# EAGLE board oresat-backplane-2u-hasp (EAGLE 9.6.2)
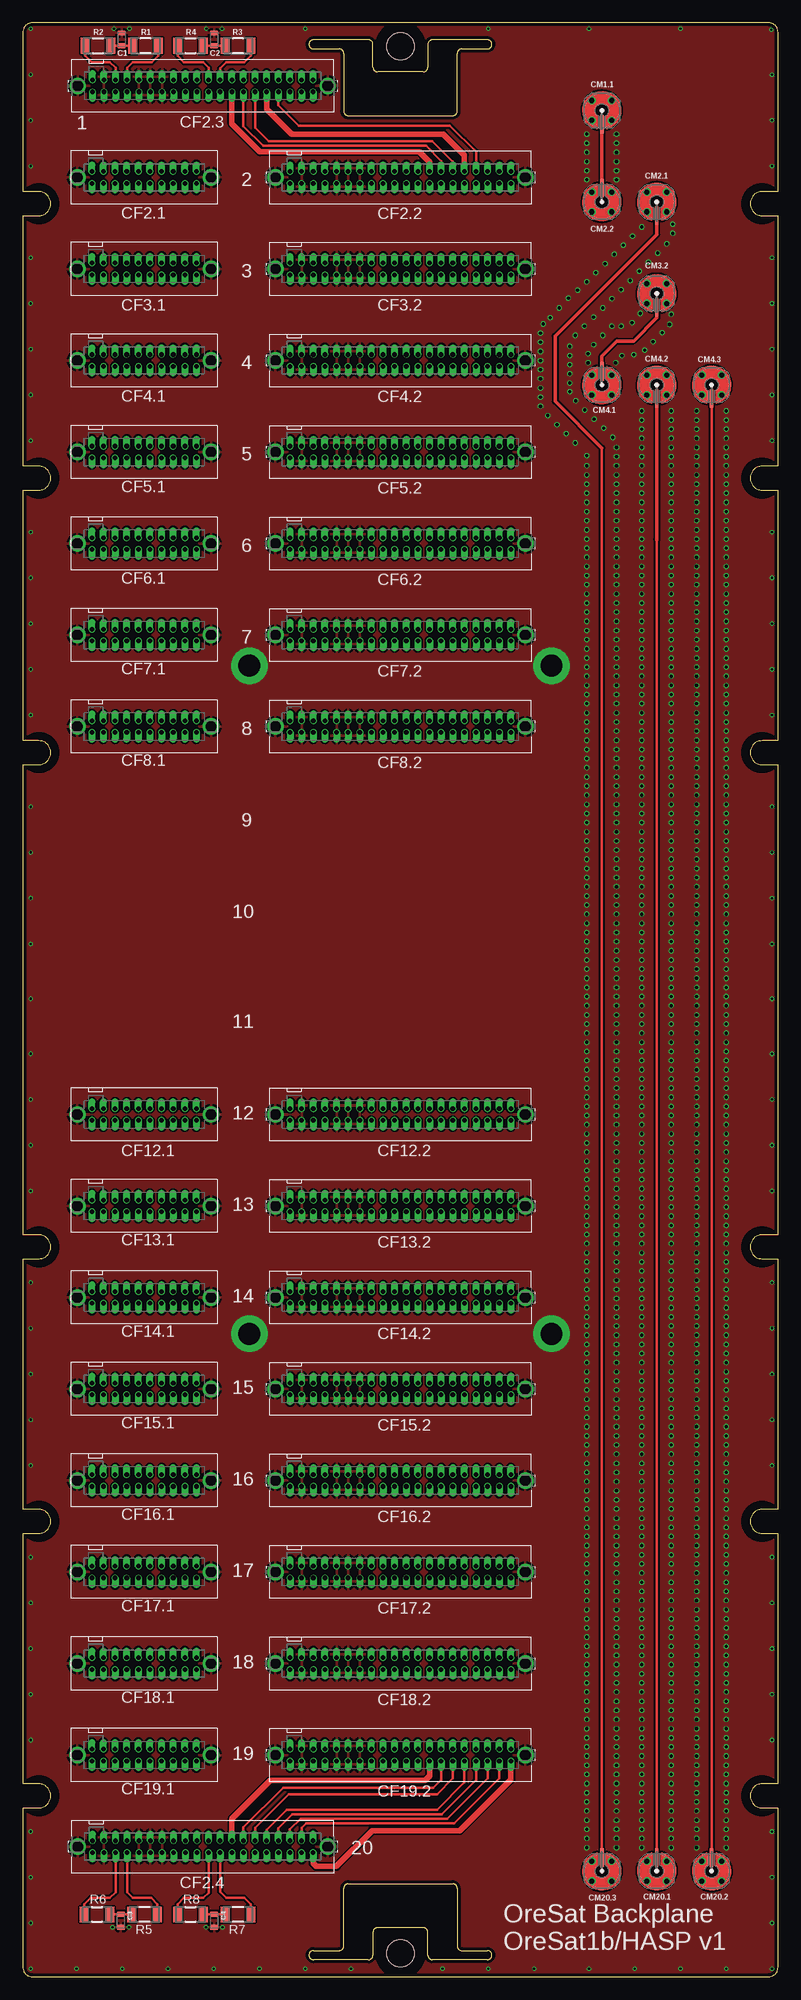
[diagram p20: board, top side]
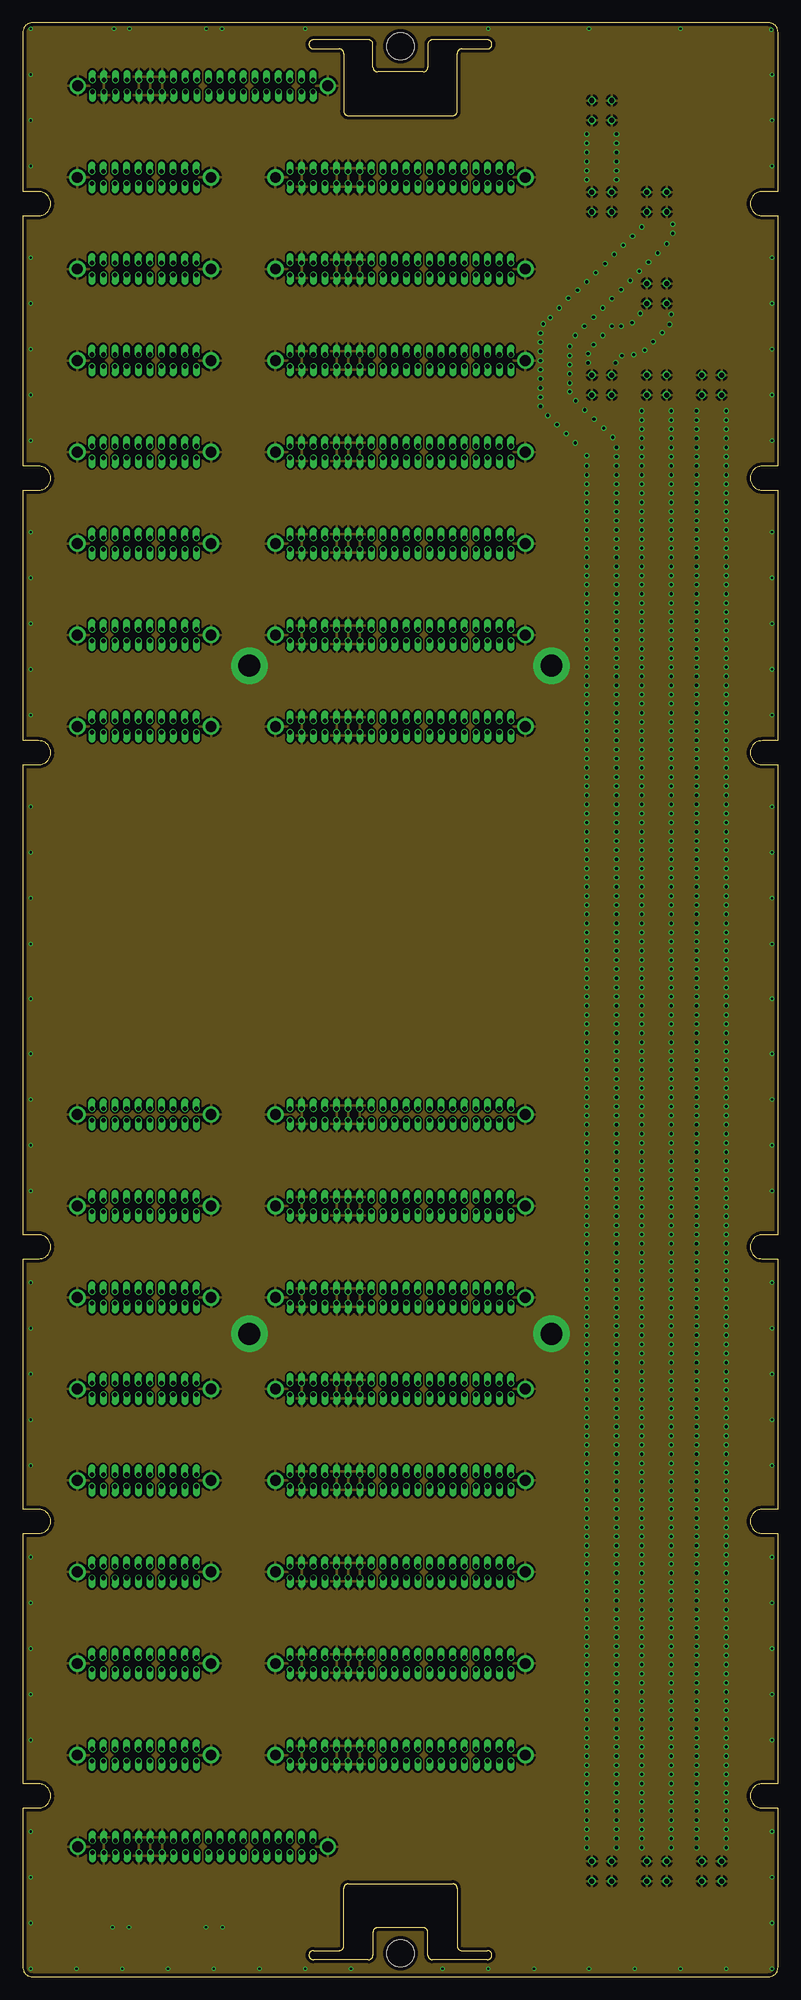
[diagram p21: board, inner layer Route2]
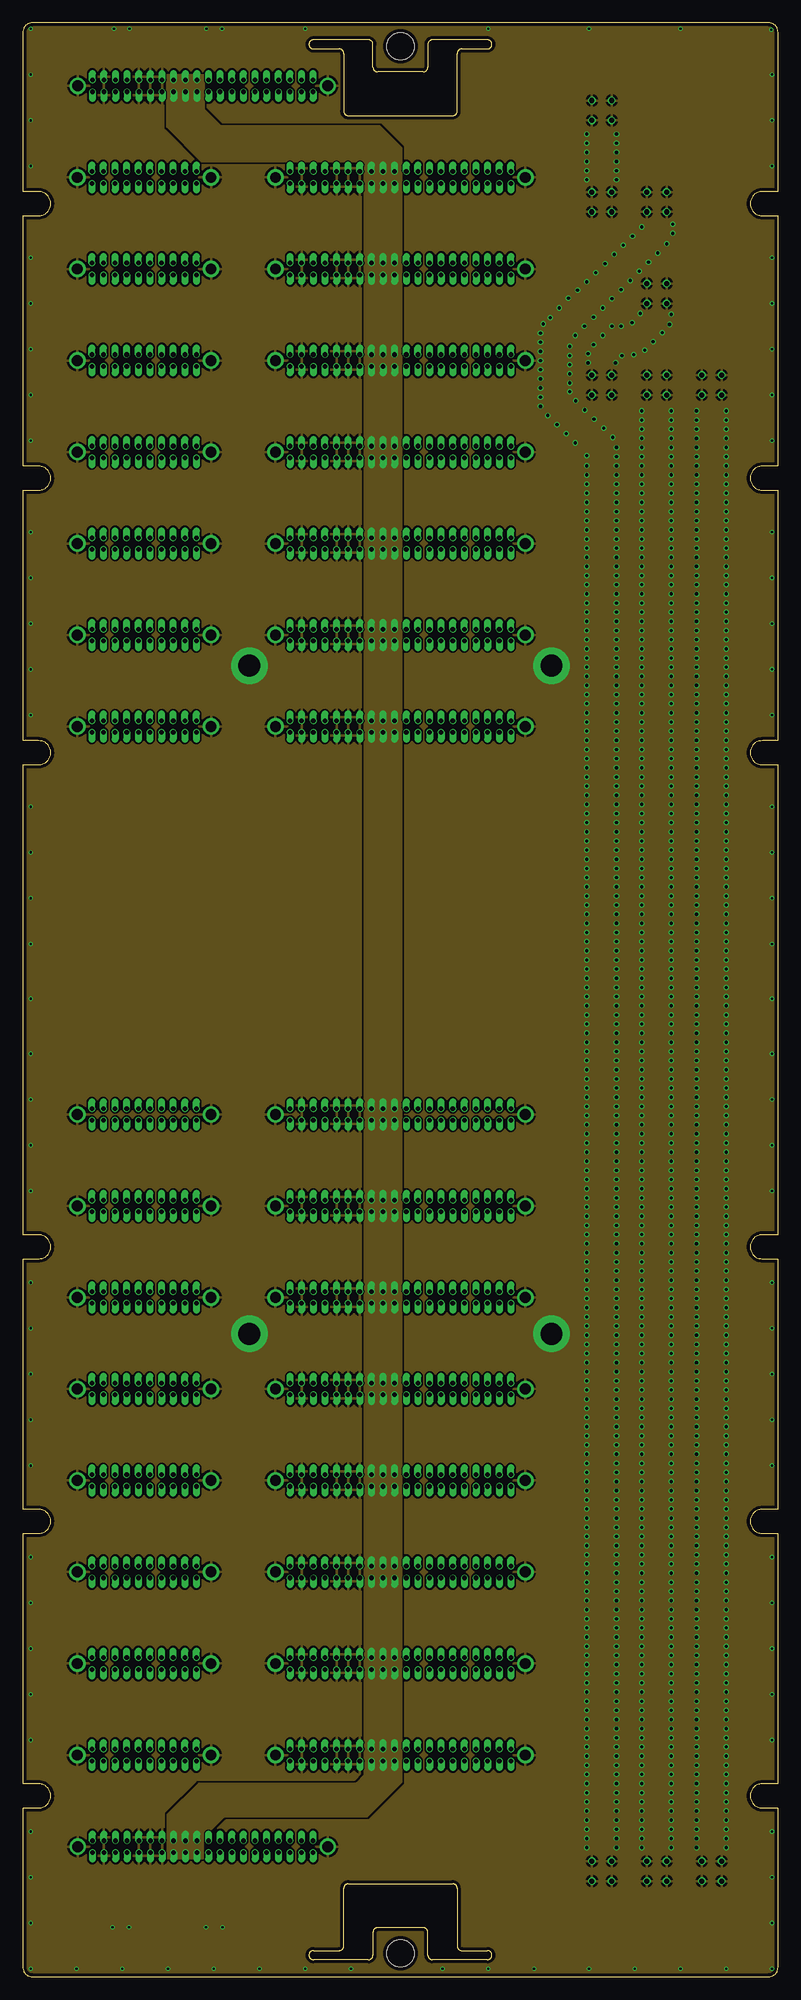
[diagram p22: board, inner layer Route15]
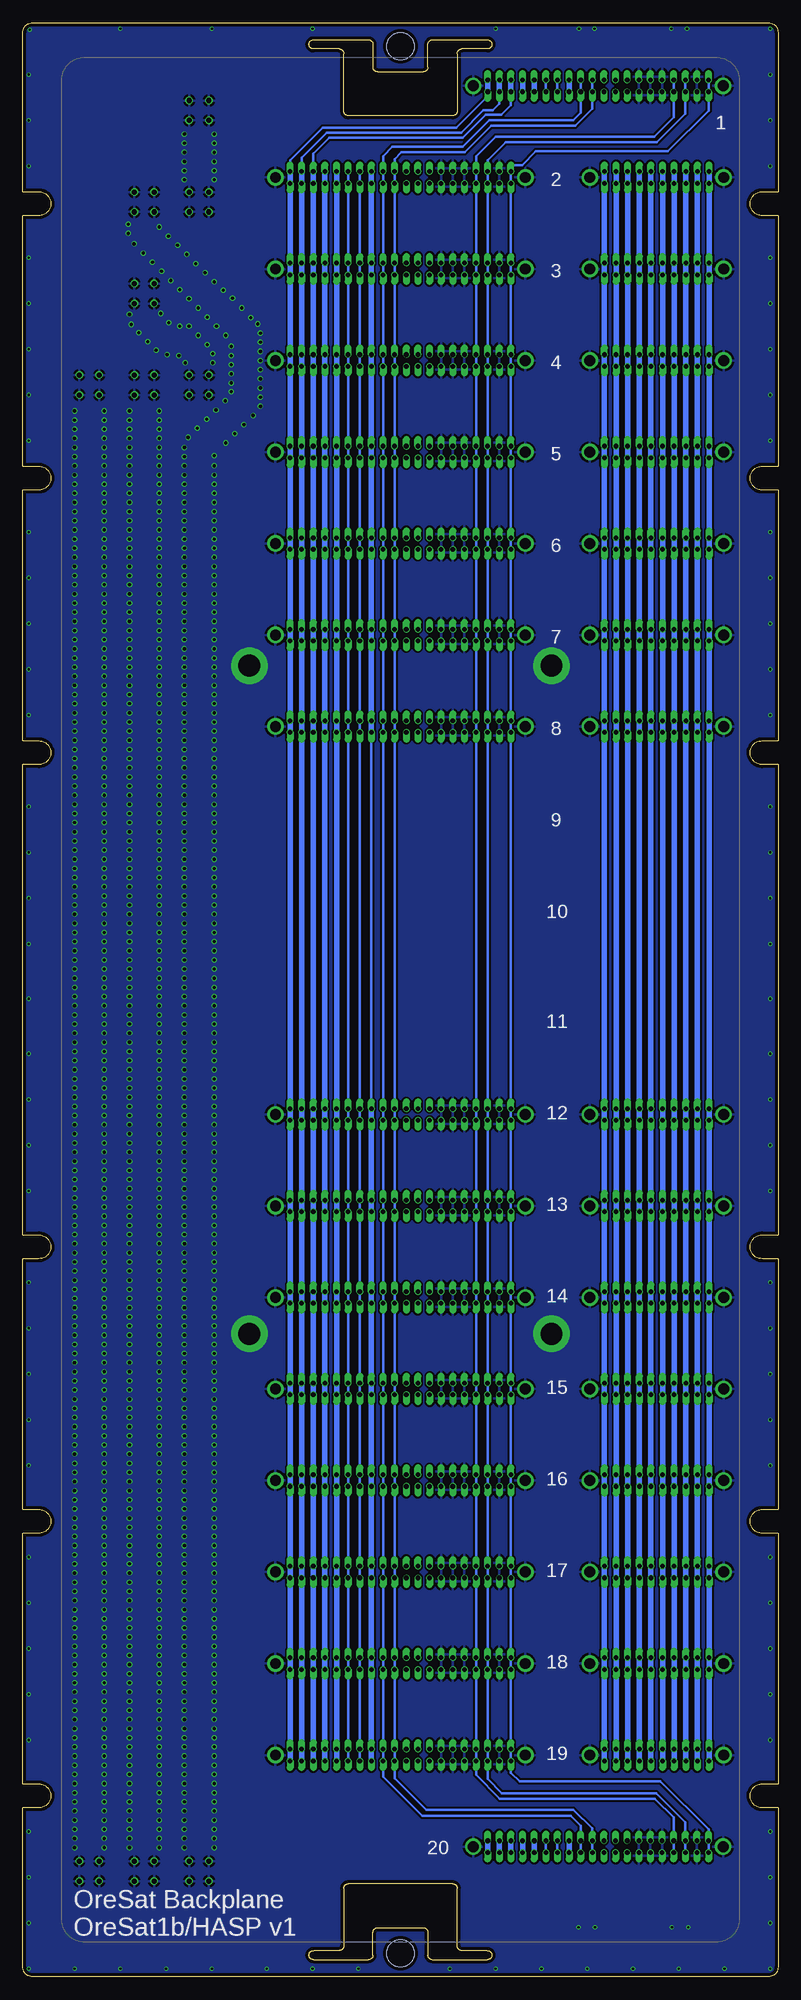
[diagram p23: board, bottom side, seen from below]

Size 82.5 x 213.5 mm. Coordinates in mm from the lower left corner, seen from the top.
Outline: 82.5,21.05 80.75,21.05 arc180 80.75,18.45 82.5,18.45 82.5,1 arc-90 81.5,0 1,0 arc-90 0,1 0,18.45 1.75,18.45 arc180 1.75,21.05 0,21.05 0,48.45 1.75,48.45 arc180 1.75,51.05 0,51.05 0,78.45 1.75,78.45 arc180 1.75,81.05 0,81.05 0,132.45 1.75,132.45 arc180 1.75,135.05 0,135.05 0,162.45 1.75,162.45 arc180 1.75,165.05 0,165.05 0,192.45 1.75,192.45 arc180 1.75,195.05 0,195.05 0,212.5 arc-90 1,213.5 81.5,213.5 arc-90 82.5,212.5 82.5,195.05 80.75,195.05 arc180 80.75,192.45 82.5,192.45 82.5,165.05 80.75,165.05 arc180 80.75,162.45 82.5,162.45 82.5,135.05 80.75,135.05 arc180 80.75,132.45 82.5,132.45 82.5,81.05 80.75,81.05 arc180 80.75,78.45 82.5,78.45 82.5,51.05 80.75,51.05 arc180 80.75,48.45 82.5,48.45 82.5,21.05
Outline: 37.75,211.65 31.75,211.65 arc180 31.75,210.65 34.55,210.65 arc-90 35.05,210.15 35.05,203.85 arc90 35.55,203.35 46.95,203.35 arc90 47.45,203.85 47.45,210.15 arc-90 47.95,210.65 50.75,210.65 arc180 50.75,211.65 44.75,211.65 arc90 44.25,211.15 44.25,208.65 arc-90 43.75,208.15 38.75,208.15 arc-90 38.25,208.65 38.25,211.15 arc90 37.75,211.65
Outline: 37.75,1.85 31.75,1.85 arc-180 31.75,2.85 34.55,2.85 arc90 35.05,3.35 35.05,9.65 arc-90 35.55,10.15 46.95,10.15 arc-90 47.45,9.65 47.45,3.35 arc90 47.95,2.85 50.75,2.85 arc-180 50.75,1.85 44.75,1.85 arc-90 44.25,2.35 44.25,4.85 arc90 43.75,5.35 38.75,5.35 arc90 38.25,4.85 38.25,2.35 arc-90 37.75,1.85
Copper layers (1*2*15*16): Top 0.035559375mm / dielectric 0.17018125mm / Route2 0.01778125mm / dielectric 47mil / Route15 0.01778125mm / dielectric 0.17018125mm / Bottom 0.035559375mm
Design rules "oshpark-4layer-tented": minimum track width 5mil, minimum drill 10mil, track to track 5mil, track to pad 5mil, pad to pad 5mil, via to via 5mil, smd to smd 5mil, copper to edge 15mil, drill to drill 6mil, minimum pad ring 4mil, minimum via ring 4mil, stop-mask expansion 2.5mil, vias tented up to drill 20mil, thermal gap 10mil
Net classes: 1 RF: width 0.29 mm, clearance 1 mm
Holes 3 mm at 41.25,2.55 41.25,210.95
tRestrict: area 78.8,131.8 to 82.8,135.8; area 78.8,161.8 to 82.8,165.8; area 78.8,191.8 to 82.8,195.8; area 78.8,77.8 to 82.8,81.8; area 78.8,47.8 to 82.8,51.8; area 78.8,17.8 to 82.8,21.8; area -0.2,17.8 to 3.8,21.8; area -0.2,47.8 to 3.8,51.8; area -0.2,77.8 to 3.8,81.8; area -0.2,131.8 to 3.8,135.8; area -0.2,161.8 to 3.8,165.8; area -0.2,191.8 to 3.8,195.8; area 38.8,0 to 43.8,5; area 38.8,208.4 to 43.8,213.4

## Footprints (pad centres in the part's own frame; a part is rotated, then mirrored left to right if it is on the bottom)
.0603-C-NOSILK = smd 0.6 x 0.9: 1 -0.7,0; 2 0.7,0
SFM-110-X1-XXX-D-LC = drill 0.5 offset: 1 5.715,-0.635; 2 5.715,0.635; 3 4.445,-0.635; 4 4.445,0.635; 5 3.175,-0.635; 6 3.175,0.635; 7 1.905,-0.635; 8 1.905,0.635; 9 0.635,-0.635; 10 0.635,0.635; 11 -0.635,-0.635; 12 -0.635,0.635; 13 -1.905,-0.635; 14 -1.905,0.635; 15 -3.175,-0.635; 16 -3.175,0.635; 17 -4.445,-0.635; 18 -4.445,0.635; 19 -5.715,-0.635; 20 -5.715,0.635 | drill 1.194: LC1 7.303,0; LC2 -7.303,0
SFM-120-X1-XXX-D = drill 0.5 offset: 1 12.065,-0.635; 2 12.065,0.635; 3 10.795,-0.635; 4 10.795,0.635; 5 9.525,-0.635; 6 9.525,0.635; 7 8.255,-0.635; 8 8.255,0.635; 9 6.985,-0.635; 10 6.985,0.635; 11 5.715,-0.635; 12 5.715,0.635; 13 4.445,-0.635; 14 4.445,0.635; 15 3.175,-0.635; 16 3.175,0.635; 17 1.905,-0.635; 18 1.905,0.635; 19 0.635,-0.635; 20 0.635,0.635; 21 -0.635,-0.635; 22 -0.635,0.635; 23 -1.905,-0.635; 24 -1.905,0.635; 25 -3.175,-0.635; 26 -3.175,0.635; 27 -4.445,-0.635; 28 -4.445,0.635; 29 -5.715,-0.635; 30 -5.715,0.635; 31 -6.985,-0.635; 32 -6.985,0.635; 33 -8.255,-0.635; 34 -8.255,0.635; 35 -9.525,-0.635; 36 -9.525,0.635; 37 -10.795,-0.635; 38 -10.795,0.635; 39 -12.065,-0.635; 40 -12.065,0.635 | drill 1.194: LC1 13.652,0; LC2 -13.652,0
J-MOLEX-SMPM-73300-0111X = drill 0.55: P$1 -1.08,-1.09; P$2 1.08,-1.09; P$3 1.08,1.09; P$4 -1.08,1.09 | smd 0.38 x 2: RF-DOWN 0,1.5
1206-C = smd 0.95 x 1.7: 1 -1.4,0; 2 1.4,0

## Placement (x,y rotation side)
C1  1n  [.0603-C-NOSILK]  10.8,211.7 90 top
C2  1n  [.0603-C-NOSILK]  20.9,211.7 90 top
C3  1n  [.0603-C-NOSILK]  10.7,6.1 270 top
C4  1n  [.0603-C-NOSILK]  20.9,6.1 270 top
CF2.1  SFM-110-X1-XXX-D-LC  [SFM-110-X1-XXX-D-LC]  13.25,196.61 0 top
CF2.2  SFM-120-X1-XXX-D  [SFM-120-X1-XXX-D]  41.25,196.61 0 top
CF2.3  SFM-120-X1-XXX-D  [SFM-120-X1-XXX-D]  19.65,206.61 0 top
CF2.4  SFM-120-X1-XXX-D  [SFM-120-X1-XXX-D]  19.65,14.21 0 top
CF3.1  SFM-110-X1-XXX-D-LC  [SFM-110-X1-XXX-D-LC]  13.25,186.61 0 top
CF3.2  SFM-120-X1-XXX-D  [SFM-120-X1-XXX-D]  41.25,186.61 0 top
CF4.1  SFM-110-X1-XXX-D-LC  [SFM-110-X1-XXX-D-LC]  13.25,176.61 0 top
CF4.2  SFM-120-X1-XXX-D  [SFM-120-X1-XXX-D]  41.25,176.61 0 top
CF5.1  SFM-110-X1-XXX-D-LC  [SFM-110-X1-XXX-D-LC]  13.25,166.61 0 top
CF5.2  SFM-120-X1-XXX-D  [SFM-120-X1-XXX-D]  41.25,166.61 0 top
CF6.1  SFM-110-X1-XXX-D-LC  [SFM-110-X1-XXX-D-LC]  13.25,156.61 0 top
CF6.2  SFM-120-X1-XXX-D  [SFM-120-X1-XXX-D]  41.25,156.61 0 top
CF7.1  SFM-110-X1-XXX-D-LC  [SFM-110-X1-XXX-D-LC]  13.25,146.61 0 top
CF7.2  SFM-120-X1-XXX-D  [SFM-120-X1-XXX-D]  41.25,146.61 0 top
CF8.1  SFM-110-X1-XXX-D-LC  [SFM-110-X1-XXX-D-LC]  13.25,136.61 0 top
CF8.2  SFM-120-X1-XXX-D  [SFM-120-X1-XXX-D]  41.25,136.61 0 top
CF12.1  SFM-110-X1-XXX-D-LC  [SFM-110-X1-XXX-D-LC]  13.25,94.21 0 top
CF12.2  SFM-120-X1-XXX-D  [SFM-120-X1-XXX-D]  41.25,94.21 0 top
CF13.1  SFM-110-X1-XXX-D-LC  [SFM-110-X1-XXX-D-LC]  13.25,84.21 0 top
CF13.2  SFM-120-X1-XXX-D  [SFM-120-X1-XXX-D]  41.25,84.21 0 top
CF14.1  SFM-110-X1-XXX-D-LC  [SFM-110-X1-XXX-D-LC]  13.25,74.21 0 top
CF14.2  SFM-120-X1-XXX-D  [SFM-120-X1-XXX-D]  41.25,74.21 0 top
CF15.1  SFM-110-X1-XXX-D-LC  [SFM-110-X1-XXX-D-LC]  13.25,64.21 0 top
CF15.2  SFM-120-X1-XXX-D  [SFM-120-X1-XXX-D]  41.25,64.21 0 top
CF16.1  SFM-110-X1-XXX-D-LC  [SFM-110-X1-XXX-D-LC]  13.25,54.21 0 top
CF16.2  SFM-120-X1-XXX-D  [SFM-120-X1-XXX-D]  41.25,54.21 0 top
CF17.1  SFM-110-X1-XXX-D-LC  [SFM-110-X1-XXX-D-LC]  13.25,44.21 0 top
CF17.2  SFM-120-X1-XXX-D  [SFM-120-X1-XXX-D]  41.25,44.21 0 top
CF18.1  SFM-110-X1-XXX-D-LC  [SFM-110-X1-XXX-D-LC]  13.25,34.21 0 top
CF18.2  SFM-120-X1-XXX-D  [SFM-120-X1-XXX-D]  41.25,34.21 0 top
CF19.1  SFM-110-X1-XXX-D-LC  [SFM-110-X1-XXX-D-LC]  13.25,24.21 0 top
CF19.2  SFM-120-X1-XXX-D  [SFM-120-X1-XXX-D]  41.25,24.21 0 top
CM1.1  J-MOLEX-SMPM-73300-0111X  [J-MOLEX-SMPM-73300-0111X]  63.25,203.93 180 top
CM2.1  J-MOLEX-SMPM-73300-0111X  [J-MOLEX-SMPM-73300-0111X]  69.25,193.93 180 top
CM2.2  J-MOLEX-SMPM-73300-0111X  [J-MOLEX-SMPM-73300-0111X]  63.25,193.93 0 top
CM3.2  J-MOLEX-SMPM-73300-0111X  [J-MOLEX-SMPM-73300-0111X]  69.25,183.93 180 top
CM4.1  J-MOLEX-SMPM-73300-0111X  [J-MOLEX-SMPM-73300-0111X]  63.25,173.93 0 top
CM4.2  J-MOLEX-SMPM-73300-0111X  [J-MOLEX-SMPM-73300-0111X]  69.25,173.93 180 top
CM4.3  J-MOLEX-SMPM-73300-0111X  [J-MOLEX-SMPM-73300-0111X]  75.25,173.93 180 top
CM20.1  J-MOLEX-SMPM-73300-0111X  [J-MOLEX-SMPM-73300-0111X]  69.25,11.53 0 top
CM20.2  J-MOLEX-SMPM-73300-0111X  [J-MOLEX-SMPM-73300-0111X]  75.25,11.53 0 top
CM20.3  J-MOLEX-SMPM-73300-0111X  [J-MOLEX-SMPM-73300-0111X]  63.25,11.53 0 top
R1  60.4  [1206-C]  13.4,211 180 top
R2  60.4  [1206-C]  8.2,211 0 top
R3  60.4  [1206-C]  23.5,211 180 top
R4  60.4  [1206-C]  18.3,211 0 top
R5  60.4  [1206-C]  13.3,6.8 180 top
R6  60.4  [1206-C]  8.1,6.8 0 top
R7  60.4  [1206-C]  23.5,6.8 180 top
R8  60.4  [1206-C]  18.3,6.8 0 top

## Tracks (layer width: path | path; a pad name or v marks a point on that pad's centre or on a via)
!SD
  Bottom 0.3: CF2.4.39 CF2.4.40 7.58,16.07 12.85,21.34 28.24,21.34 29.18,22.29 CF19.2.39 CF19.2.40 CF18.2.39 CF18.2.40 CF17.2.39 CF17.2.40 CF16.2.39 CF16.2.40 CF15.2.39 CF15.2.40 CF14.2.39 CF14.2.40 CF13.2.39 CF13.2.40 CF12.2.39 CF12.2.40 CF8.2.39 CF8.2.40 CF7.2.39 CF7.2.40 CF6.2.39 CF6.2.40 CF5.2.39 CF5.2.40 CF4.2.39 CF4.2.40 CF3.2.39 CF3.2.40 CF2.2.39 CF2.2.40 29.18,197.94 27.95,197.94 26.45,199.45 12.05,199.45 7.58,203.91 CF2.3.39 CF2.3.40
AUX-1
  Bottom 0.6: CF19.1.1 CF19.1.2 CF18.1.1 CF18.1.2 CF17.1.1 CF17.1.2 CF16.1.1 CF16.1.2 CF15.1.1 CF15.1.2 CF14.1.1 CF14.1.2 CF13.1.1 CF13.1.2 CF12.1.1 CF12.1.2 CF8.1.1 CF8.1.2 CF7.1.1 CF7.1.2 CF6.1.1 CF6.1.2 CF5.1.1 CF5.1.2 CF4.1.1 CF4.1.2 CF3.1.1 CF3.1.2 CF2.1.1 CF2.1.2
AUX-2
  Bottom 0.6: CF19.1.3 CF19.1.4 CF18.1.3 CF18.1.4 CF17.1.3 CF17.1.4 CF16.1.3 CF16.1.4 CF15.1.3 CF15.1.4 CF14.1.3 CF14.1.4 CF13.1.3 | CF4.1.4 CF4.1.3 | CF5.1.4 CF5.1.3 | CF6.1.4 CF6.1.3 | CF13.1.4 CF13.1.3 | CF6.1.3 CF7.1.4 CF7.1.3 CF8.1.4 CF8.1.3 CF12.1.4 CF12.1.3 CF13.1.3 | CF6.1.3 CF5.1.3 | CF4.1.3 CF3.1.3 CF3.1.4 CF2.1.3 CF2.1.4 | CF4.1.3 CF5.1.3
AUX-3
  Bottom 0.6: CF19.1.5 CF19.1.6 CF18.1.5 CF18.1.6 CF17.1.5 CF17.1.6 CF16.1.5 CF16.1.6 CF15.1.5 CF15.1.6 CF14.1.5 CF14.1.6 CF13.1.5 CF13.1.6 CF12.1.5 CF12.1.6 CF8.1.5 | CF4.1.6 CF4.1.5 | CF5.1.6 CF5.1.5 | CF6.1.6 CF6.1.5 | CF7.1.6 CF7.1.5 | CF8.1.6 CF8.1.5 | CF7.1.5 CF6.1.5 | CF4.1.5 CF3.1.5 CF3.1.6 CF2.1.5 CF2.1.6 | CF6.1.5 CF5.1.5 | CF5.1.5 CF4.1.5 | CF7.1.5 CF8.1.5
AUX-4
  Bottom 0.6: CF19.1.7 CF19.1.8 CF18.1.7 CF18.1.8 CF17.1.7 CF17.1.8 CF16.1.7 CF16.1.8 CF15.1.7 CF15.1.8 CF14.1.7 CF14.1.8 CF13.1.7 CF13.1.8 CF12.1.7 CF12.1.8 CF8.1.7 CF8.1.8 CF7.1.7 CF7.1.8 CF6.1.7 | CF4.1.8 CF4.1.7 | CF5.1.8 CF5.1.7 | CF6.1.8 CF6.1.7 | CF5.1.7 CF6.1.7 | CF4.1.7 CF5.1.7 | CF4.1.7 CF3.1.7 CF3.1.8 CF2.1.7 CF2.1.8
AUX-5
  Bottom 0.6: CF19.1.9 CF19.1.10 CF18.1.9 CF18.1.10 CF17.1.9 CF17.1.10 CF16.1.9 CF16.1.10 CF15.1.9 CF15.1.10 CF14.1.9 CF14.1.10 CF13.1.9 CF13.1.10 CF12.1.9 CF12.1.10 CF8.1.9 CF8.1.10 CF7.1.9 | CF4.1.10 CF4.1.9 | CF5.1.10 CF5.1.9 | CF6.1.10 CF6.1.9 | CF7.1.10 CF7.1.9 | CF7.1.9 CF6.1.9 | CF6.1.9 CF5.1.9 | CF4.1.9 CF5.1.9 | CF4.1.9 CF3.1.9 CF3.1.10 CF2.1.9 CF2.1.10
AUX-6
  Bottom 0.6: CF19.1.11 CF19.1.12 CF18.1.11 CF18.1.12 CF17.1.11 CF17.1.12 CF16.1.11 CF16.1.12 CF15.1.11 CF15.1.12 CF14.1.11 | CF14.1.12 CF14.1.11 | CF4.1.12 CF4.1.11 | CF5.1.12 CF5.1.11 | CF6.1.12 CF6.1.11 | CF7.1.12 CF7.1.11 | CF8.1.12 CF8.1.11 | CF8.1.11 CF7.1.11 | CF14.1.11 CF13.1.11 CF13.1.12 CF12.1.11 CF12.1.12 CF8.1.11 | CF7.1.11 CF6.1.11 | CF6.1.11 CF5.1.11 | CF4.1.11 CF5.1.11 | CF4.1.11 CF3.1.11 CF3.1.12 CF2.1.11 CF2.1.12
AUX-7
  Bottom 0.6: CF19.1.13 CF19.1.14 CF18.1.13 CF18.1.14 CF17.1.13 CF17.1.14 CF16.1.13 CF16.1.14 CF15.1.13 CF15.1.14 CF14.1.13 CF14.1.14 CF13.1.13 CF13.1.14 CF12.1.13 CF12.1.14 CF8.1.13 | CF4.1.14 CF4.1.13 | CF5.1.14 CF5.1.13 | CF6.1.14 CF6.1.13 | CF7.1.14 CF7.1.13 | CF8.1.14 CF8.1.13 | CF8.1.13 CF7.1.13 | CF7.1.13 CF6.1.13 | CF6.1.13 CF5.1.13 | CF4.1.13 CF5.1.13 | CF4.1.13 CF3.1.13 CF3.1.14 CF2.1.13 CF2.1.14
AUX-8
  Bottom 0.6: CF19.1.15 CF19.1.16 CF18.1.15 CF18.1.16 CF17.1.15 CF17.1.16 CF16.1.15 CF16.1.16 CF15.1.15 CF15.1.16 CF14.1.15 CF14.1.16 CF13.1.15 CF13.1.16 CF12.1.15 CF12.1.16 10.07,135.62 10.05,135.65 10.07,135.68 CF8.1.15 | CF4.1.16 CF4.1.15 | CF5.1.16 CF5.1.15 | CF6.1.16 CF6.1.15 | CF7.1.16 CF7.1.15 | CF8.1.16 CF8.1.15 | CF8.1.15 CF7.1.15 | CF7.1.15 CF6.1.15 | CF5.1.15 CF4.1.15 | CF4.1.15 CF3.1.15 CF3.1.16 CF2.1.15 CF2.1.16 | CF6.1.15 CF5.1.15
AUX-9
  Bottom 0.6: CF19.1.17 CF19.1.18 CF18.1.17 CF18.1.18 CF17.1.17 CF17.1.18 CF16.1.17 CF16.1.18 CF15.1.17 CF15.1.18 CF14.1.17 | CF14.1.17 CF14.1.18 | CF13.1.18 CF13.1.17 | CF4.1.18 CF4.1.17 | CF5.1.18 CF5.1.17 | CF6.1.18 CF6.1.17 | CF7.1.18 CF7.1.17 | CF8.1.18 CF8.1.17 | CF5.1.17 CF4.1.17 | CF8.1.17 CF7.1.17 | CF13.1.17 CF12.1.17 CF12.1.18 CF8.1.17 | CF6.1.17 CF5.1.17 | CF7.1.17 CF6.1.17 | CF4.1.17 CF3.1.17 CF3.1.18 CF2.1.17 CF2.1.18 | CF13.1.17 CF14.1.17
AUX-10
  Bottom 0.6: CF19.1.19 CF19.1.20 CF18.1.19 CF18.1.20 CF17.1.19 CF17.1.20 CF16.1.19 CF16.1.20 CF15.1.19 CF15.1.20 CF14.1.19 CF14.1.20 CF13.1.19 CF13.1.20 CF12.1.19 CF12.1.20 CF8.1.19 CF8.1.20 CF7.1.19 CF7.1.20 CF6.1.19 CF6.1.20 CF5.1.19 CF5.1.20 CF4.1.19 CF4.1.20 CF3.1.19 CF3.1.20 CF2.1.19 CF2.1.20
CAN1_H
  Top 0.3: CF2.3.34 11.39,208.59 12,209.2 14.1,209.2 14.8,209.9 R1.1 | CF2.4.33 11.39,9.21 12,8.6 14,8.6 14.7,7.9 R5.1
  Bottom 0.3: CF2.3.34 CF2.3.33 11.39,203.21 13.55,201.05 30.85,201.05 32.99,198.91 CF2.2.34 CF2.2.33 CF3.2.34 CF3.2.33 CF4.2.34 CF4.2.33 CF5.2.34 CF5.2.33 CF6.2.34 CF6.2.33 CF7.2.34 CF7.2.33 CF8.2.34 CF8.2.33 CF12.2.34 CF12.2.33 CF13.2.34 CF13.2.33 CF14.2.34 CF14.2.33 CF15.2.34 CF15.2.33 CF16.2.34 CF16.2.33 CF17.2.34 CF17.2.33 CF18.2.34 CF18.2.33 CF19.2.34 CF19.2.33 32.99,22.05 30.39,19.45 13.46,19.45 11.39,17.39 CF2.4.34 CF2.4.33
CAN1_L
  Top 0.3: CF2.3.36 10.12,208.57 9.5,209.2 7.5,209.2 6.8,209.9 R2.1 | CF2.4.35 10.12,9.22 9.5,8.6 7.4,8.6 6.7,7.9 R6.1
  Bottom 0.3: CF2.3.36 CF2.3.35 10.12,203.57 13.25,200.45 29.75,200.45 31.73,198.47 CF2.2.36 CF2.2.35 CF3.2.36 CF3.2.35 CF4.2.36 CF4.2.35 CF5.2.36 CF5.2.35 CF6.2.36 CF6.2.35 CF7.2.36 CF7.2.35 CF8.2.36 CF8.2.35 CF12.2.36 CF12.2.35 CF13.2.36 CF13.2.35 CF14.2.36 CF14.2.35 CF15.2.36 CF15.2.35 CF16.2.36 CF16.2.35 CF17.2.36 CF17.2.35 CF18.2.36 CF18.2.35 CF19.2.36 CF19.2.35 31.73,21.59 30.18,20.05 13.29,20.05 10.12,16.89 CF2.4.36 CF2.4.35
CAN2_H
  Top 0.3: CF2.3.18 21.55,208.56 22.2,209.2 24.2,209.2 24.9,209.9 R3.1 | CF2.4.17 21.55,9.24 22.2,8.6 24.2,8.6 24.9,7.9 R7.1
  Bottom 0.3: CF2.3.18 CF2.3.17 21.55,203.69 22.39,202.85 31.55,202.85 34.45,199.95 42.15,199.95 43.16,198.94 CF2.2.18 CF2.2.17 CF3.2.18 CF3.2.17 CF4.2.18 CF4.2.17 CF5.2.18 CF5.2.17 CF6.2.18 CF6.2.17 CF7.2.18 CF7.2.17 CF8.2.18 CF8.2.17 CF12.2.18 CF12.2.17 CF13.2.18 CF13.2.17 CF14.2.18 CF14.2.17 CF15.2.18 CF15.2.17 CF16.2.18 CF16.2.17 CF17.2.18 CF17.2.17 CF18.2.18 CF18.2.17 CF19.2.18 CF19.2.17 43.16,21.86 38.85,17.55 22.65,17.55 21.55,16.45 CF2.4.18 CF2.4.17
CAN2_L
  Top 0.3: R4.1 16.9,209.9 17.6,209.2 19.7,209.2 20.3,208.6 CF2.3.20 | CF2.4.19 20.29,9.19 19.7,8.6 17.6,8.6 16.9,7.9 R8.1
  Bottom 0.3: CF2.3.20 CF2.3.19 20.29,204.12 22.15,202.25 31.35,202.25 34.25,199.35 41.15,199.35 41.88,198.62 CF2.2.20 CF2.2.19 CF3.2.20 CF3.2.19 CF4.2.20 CF4.2.19 CF5.2.20 CF5.2.19 CF6.2.20 CF6.2.19 CF7.2.20 CF7.2.19 CF8.2.20 CF8.2.19 CF12.2.20 CF12.2.19 CF13.2.20 CF13.2.19 CF14.2.20 CF14.2.19 CF15.2.20 CF15.2.19 CF16.2.20 CF16.2.19 CF17.2.20 CF17.2.19 CF18.2.20 CF18.2.19 CF19.2.20 CF19.2.19 41.88,21.68 38.45,18.25 22.35,18.25 20.29,16.18 CF2.4.20 CF2.4.19
GND  (via drill 0.25, 0.35 pad 0.25, 2.4 pad 4)
  other vias: 64.85,20.1 64.85,21.1 64.85,22.1 64.85,23.1 64.85,24.1 64.85,25.1 64.85,29.1 64.85,30.1 64.85,18.1 64.85,19.1 64.85,26.1 64.85,27.1 64.85,28.1 64.85,17.1 64.85,16.1 64.85,15.1 64.85,14.1 64.85,33.1 64.85,34.1 61.6,33.1 61.6,34.1 61.6,35.1 64.85,35.1 64.85,36.1 64.85,37.1 61.6,36.1 61.6,37.1 61.6,38.1 64.85,38.1 64.85,42.1 64.85,43.1 61.6,42.1 61.6,43.1 61.6,44.1 64.85,44.1 64.85,78.1 64.85,79.1 61.6,78.1 61.6,79.1 61.6,80.1 64.85,80.1 64.85,57.1 64.85,58.1 61.6,57.1 61.6,58.1 61.6,59.1 64.85,59.1 64.85,60.1 64.85,61.1 61.6,60.1 61.6,61.1 61.6,62.1 64.85,62.1 64.85,66.1 64.85,67.1 61.6,66.1 61.6,67.1 61.6,68.1 64.85,68.1 64.85,51.1 64.85,52.1 61.6,51.1 61.6,52.1 61.6,53.1 64.85,53.1 24.75,143.25 57.75,143.25 24.75,70.25 57.75,70.25 61.6,200.35 61.6,199.35 61.6,198.35 61.6,197.35 61.6,196.35 61.6,201.35 64.85,200.35 64.85,199.35 64.85,198.35 64.85,197.35 64.85,196.35 64.85,201.35 62.4,170.2 61.4,171.2 60.4,172.2 59.75,173.2 60.35,167.6 59.35,168.6 58.35,169.6 57.35,170.6 56.55,171.6 56.55,172.6 56.55,173.6 59.75,174.15 59.75,175.15 59.75,176.15 59.75,177.15 59.75,178.15 60.35,179.35 61.35,180.35 62.35,181.35 63.35,182.35 64.35,183.35 64.85,31.1 56.55,174.6 56.55,175.6 56.55,176.6 56.55,177.6 56.55,178.6 56.55,179.6 56.85,180.6 57.6,181.3 58.6,182.35 59.6,183.4 60.6,184.3 61.6,31.1 61.6,32.1 64.85,32.1 64.85,39.1 64.85,40.1 61.6,39.1 61.6,40.1 61.6,41.1 64.85,41.1 64.85,45.1 64.85,46.1 61.6,45.1 61.6,46.1 61.6,47.1 64.85,47.1 64.85,48.1 64.85,49.1 61.6,48.1 61.6,49.1 61.6,50.1 64.85,50.1 64.85,54.1 64.85,55.1 61.6,54.1 61.6,55.1 61.6,56.1 64.85,56.1 64.85,63.1 64.85,64.1 61.6,63.1 61.6,64.1 61.6,65.1 64.85,65.1 64.85,69.1 64.85,70.1 61.6,69.1 61.6,70.1 61.6,71.1 64.85,71.1 64.85,72.1 64.85,73.1 61.6,72.1 61.6,73.1 61.6,74.1 64.85,74.1 64.85,75.1 64.85,76.1 61.6,75.1 61.6,76.1 61.6,77.1 64.85,77.1 64.85,81.1 64.85,82.1 61.6,81.1 61.6,82.1 61.6,83.1 64.85,83.1 64.85,84.1 64.85,85.1 61.6,84.1 61.6,85.1 61.6,86.1 64.85,86.1 64.85,90.1 64.85,91.1 61.6,90.1 61.6,91.1 61.6,92.1 64.85,92.1 64.85,87.1 64.85,88.1 61.6,87.1 61.6,88.1 61.6,89.1 64.85,89.1 64.85,93.1 64.85,94.1 61.6,93.1 61.6,94.1 61.6,95.1 64.85,95.1 64.85,96.1 64.85,97.1 61.6,96.1 61.6,97.1 61.6,98.1 64.85,98.1 64.85,99.1 64.85,100.1 61.6,99.1 61.6,100.1 61.6,101.1 64.85,101.1 64.85,105.1 64.85,106.1 61.6,105.1 61.6,106.1 61.6,107.1 64.85,107.1 64.85,108.1 64.85,109.1 61.6,108.1 61.6,109.1 61.6,110.1 64.85,110.1 64.85,114.1 64.85,115.1 61.6,114.1 61.6,115.1 61.6,116.1 64.85,116.1 64.85,150.1 64.85,151.1 61.6,150.1 61.6,151.1 61.6,152.1 64.85,152.1 64.85,129.1 64.85,130.1 61.6,129.1 61.6,130.1 61.6,131.1 64.85,131.1 64.85,132.1 64.85,133.1 61.6,132.1 61.6,133.1 61.6,134.1 64.85,134.1 64.85,138.1 64.85,139.1 61.6,138.1 61.6,139.1 61.6,140.1 64.85,140.1 64.85,123.1 64.85,124.1 61.6,123.1 61.6,124.1 61.6,125.1 64.85,125.1 64.85,102.1 64.85,103.1 61.6,102.1 61.6,103.1 61.6,104.1 64.85,104.1 64.85,111.1 64.85,112.1 61.6,111.1 61.6,112.1 61.6,113.1 64.85,113.1 64.85,117.1 64.85,118.1 61.6,117.1 61.6,118.1 61.6,119.1 64.85,119.1 64.85,120.1 64.85,121.1 61.6,120.1 61.6,121.1 61.6,122.1 64.85,122.1 64.85,126.1 64.85,127.1 61.6,126.1 61.6,127.1 61.6,128.1 64.85,128.1 64.85,135.1 64.85,136.1 61.6,135.1 61.6,136.1 61.6,137.1 64.85,137.1 64.85,141.1 64.85,142.1 61.6,141.1 61.6,142.1 61.6,143.1 64.85,143.1 64.85,144.1 64.85,145.1 61.6,144.1 61.6,145.1 61.6,146.1 64.85,146.1 64.85,147.1 64.85,148.1 61.6,147.1 61.6,148.1 61.6,149.1 64.85,149.1 64.85,153.1 64.85,154.1 61.6,166.2 61.6,185.2 0.85,212.85 11.65,212.85 21.75,212.85 30.85,212.85 50.85,212.85 61.85,212.85 71.85,212.85 81.75,212.75 0.85,0.85 10.85,0.85 20.85,0.85 30.85,0.85 50.85,0.85 61.85,0.85 71.85,0.85 81.85,0.85 0.85,10.85 5.85,0.85 15.85,0.85 25.85,0.85 35.85,0.85 45.85,0.85 55.85,0.85 66.85,0.85 76.85,0.85 81.85,5.85 81.85,10.85 81.85,15.85 81.85,25.85 81.85,30.85 81.85,35.85 81.85,40.85 81.85,45.85 81.85,55.85 81.85,60.85 81.85,65.85 81.85,70.85 81.85,75.85 81.85,85.85 81.85,90.85 81.85,95.85 81.85,100.85 81.85,207.85 81.85,202.85 81.85,197.85 81.85,187.85 81.85,182.85 81.85,177.85 81.85,167.85 81.85,172.85 81.85,157.85 81.85,152.85 81.85,147.85 81.85,142.85 81.85,137.85 81.85,127.85 81.85,122.85 81.85,117.85 81.85,112.85 81.85,106.85 0.85,5.85 0.85,15.85 0.85,25.85 0.85,30.85 0.85,35.85 0.85,40.85 0.85,45.85 0.85,55.85 0.85,60.85 0.85,65.85 0.85,70.85 0.85,75.85 0.85,85.85 0.85,90.85 0.85,95.85 0.85,100.85 0.85,207.85 0.85,202.85 0.85,197.85 0.85,187.85 0.85,182.85 0.85,177.85 0.85,167.85 0.85,172.85 0.85,157.85 0.85,152.85 0.85,147.85 0.85,142.85 0.85,137.85 0.85,127.85 0.85,122.85 0.85,117.85 0.85,112.85 0.85,106.85 9.95,212.85 20.05,212.85 9.8,5.4 11.6,5.4 20,5.4 21.8,5.4 61.6,17.1 61.6,18.1 61.6,19.1 61.6,20.1 61.6,21.1 61.6,22.1 61.6,26.1 61.6,27.1 61.6,28.1 61.6,15.1 61.6,16.1 61.6,23.1 61.6,24.1 61.6,25.1 61.6,29.1 61.6,30.1 61.6,14.1 70.85,20.1 70.85,21.1 70.85,22.1 70.85,23.1 70.85,24.1 70.85,25.1 70.85,29.1 70.85,30.1 70.85,18.1 70.85,19.1 70.85,26.1 70.85,27.1 70.85,28.1 70.85,17.1 70.85,16.1 70.85,15.1 70.85,14.1 70.85,33.1 70.85,34.1 67.6,33.1 67.6,34.1 67.6,35.1 70.85,35.1 70.85,36.1 70.85,37.1 67.6,36.1 67.6,37.1 67.6,38.1 70.85,38.1 70.85,42.1 70.85,43.1 67.6,42.1 67.6,43.1 67.6,44.1 70.85,44.1 70.85,78.1 70.85,79.1 67.6,78.1 67.6,79.1 67.6,80.1 70.85,80.1 70.85,57.1 70.85,58.1 67.6,57.1 67.6,58.1 67.6,59.1 70.85,59.1 70.85,60.1 70.85,61.1 67.6,60.1 67.6,61.1 67.6,62.1 70.85,62.1 70.85,66.1 70.85,67.1 67.6,66.1 67.6,67.1 67.6,68.1 70.85,68.1 70.85,51.1 70.85,52.1 67.6,51.1 67.6,52.1 67.6,53.1 70.85,53.1 70.85,31.1 67.6,31.1 67.6,32.1 70.85,32.1 70.85,39.1 70.85,40.1 67.6,39.1 67.6,40.1 67.6,41.1 70.85,41.1 70.85,45.1 70.85,46.1 67.6,45.1 67.6,46.1 67.6,47.1 70.85,47.1 70.85,48.1 70.85,49.1 67.6,48.1 67.6,49.1 67.6,50.1 70.85,50.1 70.85,54.1 70.85,55.1 67.6,54.1 67.6,55.1 67.6,56.1 70.85,56.1 70.85,63.1 70.85,64.1 67.6,63.1 67.6,64.1 67.6,65.1 70.85,65.1 70.85,69.1 70.85,70.1 67.6,69.1 67.6,70.1 67.6,71.1 70.85,71.1 70.85,72.1 70.85,73.1 67.6,72.1 67.6,73.1 67.6,74.1 70.85,74.1 70.85,75.1 70.85,76.1 67.6,75.1 67.6,76.1 67.6,77.1 70.85,77.1 70.85,81.1 70.85,82.1 67.6,81.1 67.6,82.1 67.6,83.1 70.85,83.1 70.85,84.1 70.85,85.1 67.6,84.1 67.6,85.1 67.6,86.1 70.85,86.1 70.85,90.1 70.85,91.1 67.6,90.1 67.6,91.1 67.6,92.1 70.85,92.1 70.85,87.1 70.85,88.1 67.6,87.1 67.6,88.1 67.6,89.1 70.85,89.1 70.85,93.1 70.85,94.1 67.6,93.1 67.6,94.1 67.6,95.1 70.85,95.1 70.85,96.1 70.85,97.1 67.6,96.1 67.6,97.1 67.6,98.1 70.85,98.1 70.85,99.1 70.85,100.1 67.6,99.1 67.6,100.1 67.6,101.1 70.85,101.1 70.85,105.1 70.85,106.1 67.6,105.1 67.6,106.1 67.6,107.1 70.85,107.1 70.85,108.1 70.85,109.1 67.6,108.1 67.6,109.1 67.6,110.1 70.85,110.1 70.85,114.1 70.85,115.1 67.6,114.1 67.6,115.1 67.6,116.1 70.85,116.1 70.85,150.1 70.85,151.1 67.6,150.1 67.6,151.1 67.6,152.1 70.85,152.1 70.85,129.1 70.85,130.1 67.6,129.1 67.6,130.1 67.6,131.1 70.85,131.1 70.85,132.1 70.85,133.1 67.6,132.1 67.6,133.1 67.6,134.1 70.85,134.1 70.85,138.1 70.85,139.1 67.6,138.1 67.6,139.1 67.6,140.1 70.85,140.1 70.85,123.1 70.85,124.1 67.6,123.1 67.6,124.1 67.6,125.1 70.85,125.1 70.85,102.1 70.85,103.1 67.6,102.1 67.6,103.1 67.6,104.1 70.85,104.1 70.85,111.1 70.85,112.1 67.6,111.1 67.6,112.1 67.6,113.1 70.85,113.1 70.85,117.1 70.85,118.1 67.6,117.1 67.6,118.1 67.6,119.1 70.85,119.1 70.85,120.1 70.85,121.1 67.6,120.1 67.6,121.1 67.6,122.1 70.85,122.1 70.85,126.1 70.85,127.1 67.6,126.1 67.6,127.1 67.6,128.1 70.85,128.1 70.85,135.1 70.85,136.1 67.6,135.1 67.6,136.1 67.6,137.1 70.85,137.1 70.85,141.1 70.85,142.1 67.6,141.1 67.6,142.1 67.6,143.1 70.85,143.1 70.85,144.1 70.85,145.1 67.6,144.1 67.6,145.1 67.6,146.1 70.85,146.1 70.85,147.1 70.85,148.1 67.6,147.1 67.6,148.1 67.6,149.1 70.85,149.1 70.85,153.1 67.6,153.1 67.6,17.1 67.6,18.1 67.6,19.1 67.6,20.1 67.6,21.1 67.6,22.1 67.6,26.1 67.6,27.1 67.6,28.1 67.6,15.1 67.6,16.1 67.6,23.1 67.6,24.1 67.6,25.1 67.6,29.1 67.6,30.1 67.6,14.1 76.85,20.1 76.85,21.1 76.85,22.1 76.85,23.1 76.85,24.1 76.85,25.1 76.85,29.1 76.85,30.1 76.85,18.1 76.85,19.1 76.85,26.1 76.85,27.1 76.85,28.1 76.85,17.1 76.85,16.1 76.85,15.1 76.85,14.1 76.85,33.1 76.85,34.1 73.6,33.1 73.6,34.1 73.6,35.1 76.85,35.1 76.85,36.1 76.85,37.1 73.6,36.1 73.6,37.1 73.6,38.1 76.85,38.1 76.85,42.1 76.85,43.1 73.6,42.1 73.6,43.1 73.6,44.1 76.85,44.1 76.85,78.1 76.85,79.1 73.6,78.1 73.6,79.1 73.6,80.1 76.85,80.1 76.85,57.1 76.85,58.1 73.6,57.1 73.6,58.1 73.6,59.1 76.85,59.1 76.85,60.1 76.85,61.1 73.6,60.1 73.6,61.1 73.6,62.1 76.85,62.1 76.85,66.1 76.85,67.1 73.6,66.1 73.6,67.1 73.6,68.1 76.85,68.1 76.85,51.1 76.85,52.1 73.6,51.1 73.6,52.1 73.6,53.1 76.85,53.1 76.85,31.1 73.6,31.1 73.6,32.1 76.85,32.1 76.85,39.1 76.85,40.1 73.6,39.1 73.6,40.1 73.6,41.1 76.85,41.1 76.85,45.1 76.85,46.1 73.6,45.1 73.6,46.1 73.6,47.1 76.85,47.1 76.85,48.1 76.85,49.1 73.6,48.1 73.6,49.1 73.6,50.1 76.85,50.1 76.85,54.1 76.85,55.1 73.6,54.1 73.6,55.1 73.6,56.1 76.85,56.1 76.85,63.1 76.85,64.1 73.6,63.1 73.6,64.1 73.6,65.1 76.85,65.1 76.85,69.1 76.85,70.1 73.6,69.1 73.6,70.1 73.6,71.1 76.85,71.1 76.85,72.1 76.85,73.1 73.6,72.1 73.6,73.1 73.6,74.1 76.85,74.1 76.85,75.1 76.85,76.1 73.6,75.1 73.6,76.1 73.6,77.1 76.85,77.1 76.85,81.1 76.85,82.1 73.6,81.1 73.6,82.1 73.6,83.1 76.85,83.1 76.85,84.1 76.85,85.1 73.6,84.1 73.6,85.1 73.6,86.1 76.85,86.1 76.85,90.1 76.85,91.1 73.6,90.1 73.6,91.1 73.6,92.1 76.85,92.1 76.85,87.1 76.85,88.1 73.6,87.1 73.6,88.1 73.6,89.1 76.85,89.1 76.85,93.1 76.85,94.1 73.6,93.1 73.6,94.1 73.6,95.1 76.85,95.1 76.85,96.1 76.85,97.1 73.6,96.1 73.6,97.1 73.6,98.1 76.85,98.1 76.85,99.1 76.85,100.1 73.6,99.1 73.6,100.1 73.6,101.1 76.85,101.1 76.85,105.1 76.85,106.1 73.6,105.1 73.6,106.1 73.6,107.1 76.85,107.1 76.85,108.1 76.85,109.1 73.6,108.1 73.6,109.1 73.6,110.1 76.85,110.1 76.85,114.1 76.85,115.1 73.6,114.1 73.6,115.1 73.6,116.1 76.85,116.1 76.85,150.1 76.85,151.1 73.6,150.1 73.6,151.1 73.6,152.1 76.85,152.1 76.85,129.1 76.85,130.1 73.6,129.1 73.6,130.1 73.6,131.1 76.85,131.1 76.85,132.1 76.85,133.1 73.6,132.1 73.6,133.1 73.6,134.1 76.85,134.1 76.85,138.1 76.85,139.1 73.6,138.1 73.6,139.1 73.6,140.1 76.85,140.1 76.85,123.1 76.85,124.1 73.6,123.1 73.6,124.1 73.6,125.1 76.85,125.1 76.85,102.1 76.85,103.1 73.6,102.1 73.6,103.1 73.6,104.1 76.85,104.1 76.85,111.1 76.85,112.1 73.6,111.1 73.6,112.1 73.6,113.1 76.85,113.1 76.85,117.1 76.85,118.1 73.6,117.1 73.6,118.1 73.6,119.1 76.85,119.1 76.85,120.1 76.85,121.1 73.6,120.1 73.6,121.1 73.6,122.1 76.85,122.1 76.85,126.1 76.85,127.1 73.6,126.1 73.6,127.1 73.6,128.1 76.85,128.1 76.85,135.1 76.85,136.1 73.6,135.1 73.6,136.1 73.6,137.1 76.85,137.1 76.85,141.1 76.85,142.1 73.6,141.1 73.6,142.1 73.6,143.1 76.85,143.1 76.85,144.1 76.85,145.1 73.6,144.1 73.6,145.1 73.6,146.1 76.85,146.1 76.85,147.1 76.85,148.1 73.6,147.1 73.6,148.1 73.6,149.1 76.85,149.1 76.85,153.1 73.6,153.1 73.6,17.1 73.6,18.1 73.6,19.1 73.6,20.1 73.6,21.1 73.6,22.1 73.6,26.1 73.6,27.1 73.6,28.1 73.6,15.1 73.6,16.1 73.6,23.1 73.6,24.1 73.6,25.1 73.6,29.1 73.6,30.1 73.6,14.1 76.85,154.1 76.85,155.1 73.6,154.1 73.6,155.1 73.6,156.1 73.6,157.1 73.6,158.1 73.6,159.1 73.6,160.1 73.6,161.1 76.85,156.1 76.85,157.1 76.85,158.1 76.85,159.1 76.85,160.1 76.85,161.1 70.85,154.1 67.6,154.1 67.6,155.1 70.85,155.1 67.6,156.1 64.45,168.2 63.45,169.2 61.6,153.1 61.6,154.1 61.6,155.1 61.6,156.1 61.6,157.1 64.85,155.1 64.85,156.1 64.85,157.1 64.85,158.1 61.6,158.1 61.6,159.1 64.85,159.1 64.85,160.1 61.6,160.1 64.85,161.1 70.85,161.1 67.6,161.1 61.6,161.1 64.85,162.1 70.85,162.1 67.6,162.1 61.6,162.1 64.85,163.1 70.85,163.1 67.6,163.1 61.6,163.1 64.85,164.1 70.85,164.1 67.6,164.1 61.6,164.1 64.85,165.1 70.85,165.1 67.6,165.1 61.6,165.1 67.6,157.1 67.6,158.1 67.6,159.1 67.6,160.1 70.85,156.1 70.85,157.1 70.85,158.1 70.85,159.1 70.85,160.1 73.6,162.1 73.6,163.1 73.6,164.1 73.6,165.1 73.6,166.1 73.6,167.1 73.6,168.1 73.6,169.1 73.6,170.1 73.6,171.1 76.85,162.1 76.85,163.1 76.85,164.1 76.85,165.1 76.85,166.1 76.85,167.1 76.85,168.1 76.85,169.1 76.85,170.1 76.85,171.1 70.85,166.1 70.85,167.1 70.85,168.1 70.85,169.1 70.85,170.1 70.85,171.1 67.6,166.1 67.6,167.1 67.6,168.1 67.6,169.1 67.6,170.1 67.6,171.1 64.85,166.1 64.85,167.1 62.6,186.2 63.6,187.2 64.6,188.2 65.6,189.2 66.6,190.2 67.6,191.2 65.35,184.35 66.35,185.35 67.35,186.35 68.35,187.35 69.35,188.35 70.35,189.35 71,191.5 71,190.5 61.75,176.35 61.75,177.35 62.35,178.35 63.35,179.35 64.35,180.35 65.35,180.35 66.55,180.75 67.45,181.75 70.85,181.65 70.65,180.55 69.85,179.65 68.85,178.65 67.95,177.75 66.75,177.25 65.45,177.15 64.75,176.35
  pour Top (isolate 0.2, rank 6): 0,0 0,213.5 82.5,213.5 82.5,0
  pour Bottom (isolate 0.2, rank 6): 0,0 0,213.5 82.5,213.5 82.5,0
  pour Route2 (isolate 0.2, rank 6): 0,0 0,213.5 82.5,213.5 82.5,0
  pour Route15 (isolate 0.2, rank 6): 0,0 0,213.5 82.5,213.5 82.5,0
L-GPS
  Top 0.38: CM3.2.RF-DOWN 69.25,181.26 66.72,178.73 64.88,178.73 63.25,177.1 CM4.1.RF-DOWN
L-TURNSTILE
  Top 0.29: CM20.1.RF-DOWN 69.25,157
  Top 0.38: 69.25,157.15 69.25,157 CM4.2.RF-DOWN
N$1
  Top 0.3: R4.2 C2.1 R3.2
N$2
  Top 0.3: R2.2 C1.1 R1.2
N$3
  Top 0.3: R8.2 C4.1 R7.2
N$4
  Top 0.3: R6.2 C3.1 R5.2
OPD_PWR
  Top 0.6: CF2.2.16 44.42,198.28 43.3,199.4 25.9,199.4 22.82,202.47 CF2.3.15 | CF19.2.15 44.42,21.93 43.95,21.45 27.05,21.45 22.82,17.23 CF2.4.16
  Bottom 0.3: CF12.2.16 CF8.2.15
  Bottom 0.6: CF2.2.16 CF2.2.15 CF3.2.16 CF3.2.15 CF4.2.16 CF4.2.15 CF5.2.16 CF5.2.15 CF6.2.16 CF6.2.15 CF7.2.16 CF7.2.15 CF8.2.16 CF8.2.15 | CF12.2.16 CF12.2.15 CF13.2.16 CF13.2.15 CF14.2.16 CF14.2.15 CF15.2.16 CF15.2.15 CF16.2.16 CF16.2.15 CF17.2.16 CF17.2.15 CF18.2.16 CF18.2.15 CF19.2.16 CF19.2.15 | CF2.4.16 CF2.4.15 | CF2.3.16 CF2.3.15
OPD_SCL
  Top 0.3: CF2.2.14 45.7,198.41 44.05,200.05 26.25,200.05 24.09,202.21 CF2.3.13 | CF19.2.13 45.7,21.5 44.84,20.65 28.45,20.65 24.09,16.3 CF2.4.14
  Bottom 0.3: CF2.2.14 CF2.2.13 CF3.2.14 CF3.2.13 CF4.2.14 CF4.2.13 CF5.2.14 CF5.2.13 CF6.2.14 CF6.2.13 CF7.2.14 CF7.2.13 CF8.2.14 CF8.2.13 CF12.2.14 CF12.2.13 CF13.2.14 CF13.2.13 CF14.2.14 CF14.2.13 CF15.2.14 CF15.2.13 CF16.2.14 CF16.2.13 CF17.2.14 CF17.2.13 CF18.2.14 CF18.2.13 CF19.2.14 CF19.2.13 | CF2.4.14 CF2.4.13 | CF2.3.14 CF2.3.13
OPD_SDA
  Top 0.3: CF2.2.12 46.97,198.34 44.75,200.55 26.85,200.55 25.36,202.03 CF2.3.11 | CF19.2.11 46.97,21.66 45.25,19.95 29.05,19.95 25.36,16.27 CF2.4.12
  Bottom 0.3: CF2.2.12 CF2.2.11 CF3.2.12 CF3.2.11 CF4.2.12 CF4.2.11 CF5.2.12 CF5.2.11 CF6.2.12 CF6.2.11 CF7.2.12 CF7.2.11 CF8.2.12 CF8.2.11 CF12.2.12 CF12.2.11 CF13.2.12 CF13.2.11 CF14.2.12 | CF14.2.12 CF14.2.11 | CF14.2.12 CF15.2.12 CF15.2.11 CF16.2.12 CF16.2.11 CF17.2.12 CF17.2.11 CF18.2.12 CF18.2.11 CF19.2.12 CF19.2.11 | CF2.4.12 CF2.4.11 | CF2.3.12 CF2.3.11
S-HELICAL
  Top 0.38: CM1.1.RF-DOWN CM2.2.RF-DOWN
S-TURNSTILE
  Top 0.29: 63.25,167.05 CM20.3.RF-DOWN
  Top 0.38: 63.25,167.05 58.15,172.15 58.15,179.27 69.25,190.37 CM2.1.RF-DOWN
SPARE1
  Top 0.3: CF19.2.9 48.23,21.23 45.25,18.25 28.85,18.25 26.64,16.04 CF2.4.10 | 26.65,205.96 CF2.3.9
  Top 0.6: CF2.2.10 48.23,199.06 45.95,201.35 29.35,201.35 26.65,204.05 26.65,205.96
  Bottom 0.6: CF2.2.10 CF2.2.9 CF3.2.10 CF3.2.9 CF4.2.10 CF4.2.9 CF5.2.10 CF5.2.9 CF6.2.10 CF6.2.9 CF7.2.10 CF7.2.9 CF8.2.10 CF8.2.9 CF12.2.10 CF12.2.9 CF13.2.10 CF13.2.9 CF14.2.10 CF14.2.9 CF15.2.10 CF15.2.9 CF16.2.10 CF16.2.9 CF17.2.10 CF17.2.9 CF18.2.10 CF18.2.9 CF19.2.10 CF19.2.9 | CF2.3.10 CF2.3.9 | CF2.4.9 CF2.4.10
SPARE2
  Top 0.3: CF2.4.8 27.91,16.2 29.45,17.75 45.75,17.75 49.51,21.5 CF19.2.7 | CF2.2.8 49.51,199.4 46.65,202.25 30.15,202.25 27.91,204.5 CF2.3.7
  Bottom 0.6: CF2.2.8 CF2.2.7 CF3.2.8 CF3.2.7 CF4.2.8 CF4.2.7 CF5.2.8 CF5.2.7 CF6.2.8 CF6.2.7 CF7.2.8 CF7.2.7 CF8.2.8 CF8.2.7 CF12.2.8 CF12.2.7 CF13.2.8 CF13.2.7 CF14.2.8 CF14.2.7 CF15.2.8 CF15.2.7 CF16.2.8 CF16.2.7 CF17.2.8 CF17.2.7 CF18.2.8 CF18.2.7 CF19.2.8 CF19.2.7 | CF2.3.8 CF2.3.7 | CF2.4.7 CF2.4.8
SPARE3
  Top 0.3: CF2.4.6 29.18,16.07 30.35,17.25 46.35,17.25 50.77,21.68 CF19.2.5
  Bottom 0.3: CF2.2.6 50.77,199.22 49.05,200.95 34.45,200.95 31.95,203.45 30.25,203.45 29.18,204.53 CF2.3.5
  Bottom 0.6: CF2.2.6 CF2.2.5 CF3.2.6 CF3.2.5 CF4.2.6 CF4.2.5 CF5.2.6 CF5.2.5 CF6.2.6 CF6.2.5 CF7.2.6 CF7.2.5 CF8.2.6 CF8.2.5 CF12.2.6 CF12.2.5 CF13.2.6 CF13.2.5 CF14.2.6 CF14.2.5 CF15.2.6 CF15.2.5 CF16.2.6 CF16.2.5 CF17.2.6 CF17.2.5 CF18.2.6 CF18.2.5 CF19.2.6 CF19.2.5 | CF2.3.6 CF2.3.5 | CF2.4.5 CF2.4.6
SPARE4
  Top 0.3: CF19.2.3 52.05,21.64 47.15,16.75 30.95,16.75 30.45,16.25 CF2.4.4
  Bottom 0.3: CF2.3.3 30.45,204.66 31.15,203.95 32.2,203.95 34.63,201.52 49.28,201.52 52.05,198.75 CF2.2.4
  Bottom 0.6: CF2.2.4 CF2.2.3 CF3.2.4 CF3.2.3 CF4.2.4 CF4.2.3 CF5.2.4 CF5.2.3 CF6.2.4 CF6.2.3 CF7.2.4 CF7.2.3 CF8.2.4 CF8.2.3 CF12.2.4 CF12.2.3 CF13.2.4 CF13.2.3 CF14.2.4 CF14.2.3 CF15.2.4 CF15.2.3 CF16.2.4 CF16.2.3 CF17.2.4 CF17.2.3 CF18.2.4 CF18.2.3 CF19.2.4 CF19.2.3 | CF2.3.4 CF2.3.3 | CF2.4.3 CF2.4.4
SPARE5
  Top 0.6: CF19.2.1 53.31,21.52 47.75,15.95 38.15,15.95 34.25,12.05 32.05,12.05 31.71,12.38 CF2.4.1
  Bottom 0.3: CF2.3.1 31.75,205.94 31.75,205.45 35.15,202.05 49.75,202.05 53.31,198.49 CF2.2.2
  Bottom 0.6: CF2.2.2 CF2.2.1 CF3.2.2 CF3.2.1 CF4.2.2 CF4.2.1 CF5.2.2 CF5.2.1 CF6.2.2 CF6.2.1 CF7.2.2 CF7.2.1 CF8.2.2 CF8.2.1 CF12.2.2 CF12.2.1 CF13.2.2 CF13.2.1 CF14.2.2 CF14.2.1 CF15.2.2 CF15.2.1 CF16.2.2 CF16.2.1 CF17.2.2 CF17.2.1 CF18.2.2 CF18.2.1 CF19.2.2 CF19.2.1 | CF2.3.2 CF2.3.1 | CF2.4.1 CF2.4.2
U-TURNSTILE
  Top 0.29: CM20.2.RF-DOWN CM4.3.RF-DOWN
VBUS
  pour Route15 (rank 2, no thermals): 15.85,12.85 15.85,17.75 19.25,21.15 36.45,21.15 37.35,22.05 37.35,197.75 36.75,198.35 19.55,198.35 15.75,202.15 15.75,207.85 19.75,207.85 19.75,204.05 21.55,202.25 38.95,202.25 41.35,199.85 41.35,21.25 37.55,17.45 21.95,17.45 19.65,15.15 19.65,12.85

## Text on the board
tPlace: 1 | 2 | 3 | 4 | 5 | 6 | 7 | 8 | 9 | 10 | 11 | 12 | 13 | 14 | 15 | 16 | 17 | 18 | 19 | 20 | OreSat Backplane / OreSat1b/HASP v1
bPlace: 1 | 2 | 3 | 4 | 5 | 6 | 7 | 8 | 9 | 10 | 11 | 12 | 13 | 14 | 15 | 16 | 17 | 18 | 19 | 20 | OreSat Backplane / OreSat1b/HASP v1